# EAGLE schematic PCB_Accessoire_Puissance_ED0B (EAGLE 9.6.0)
APP_SCH: Alex; AUTHOR_SCH: Alexandre LEMAIRE; DESC_SCH: Power Switch 12V 10A; REV_HIST: 0
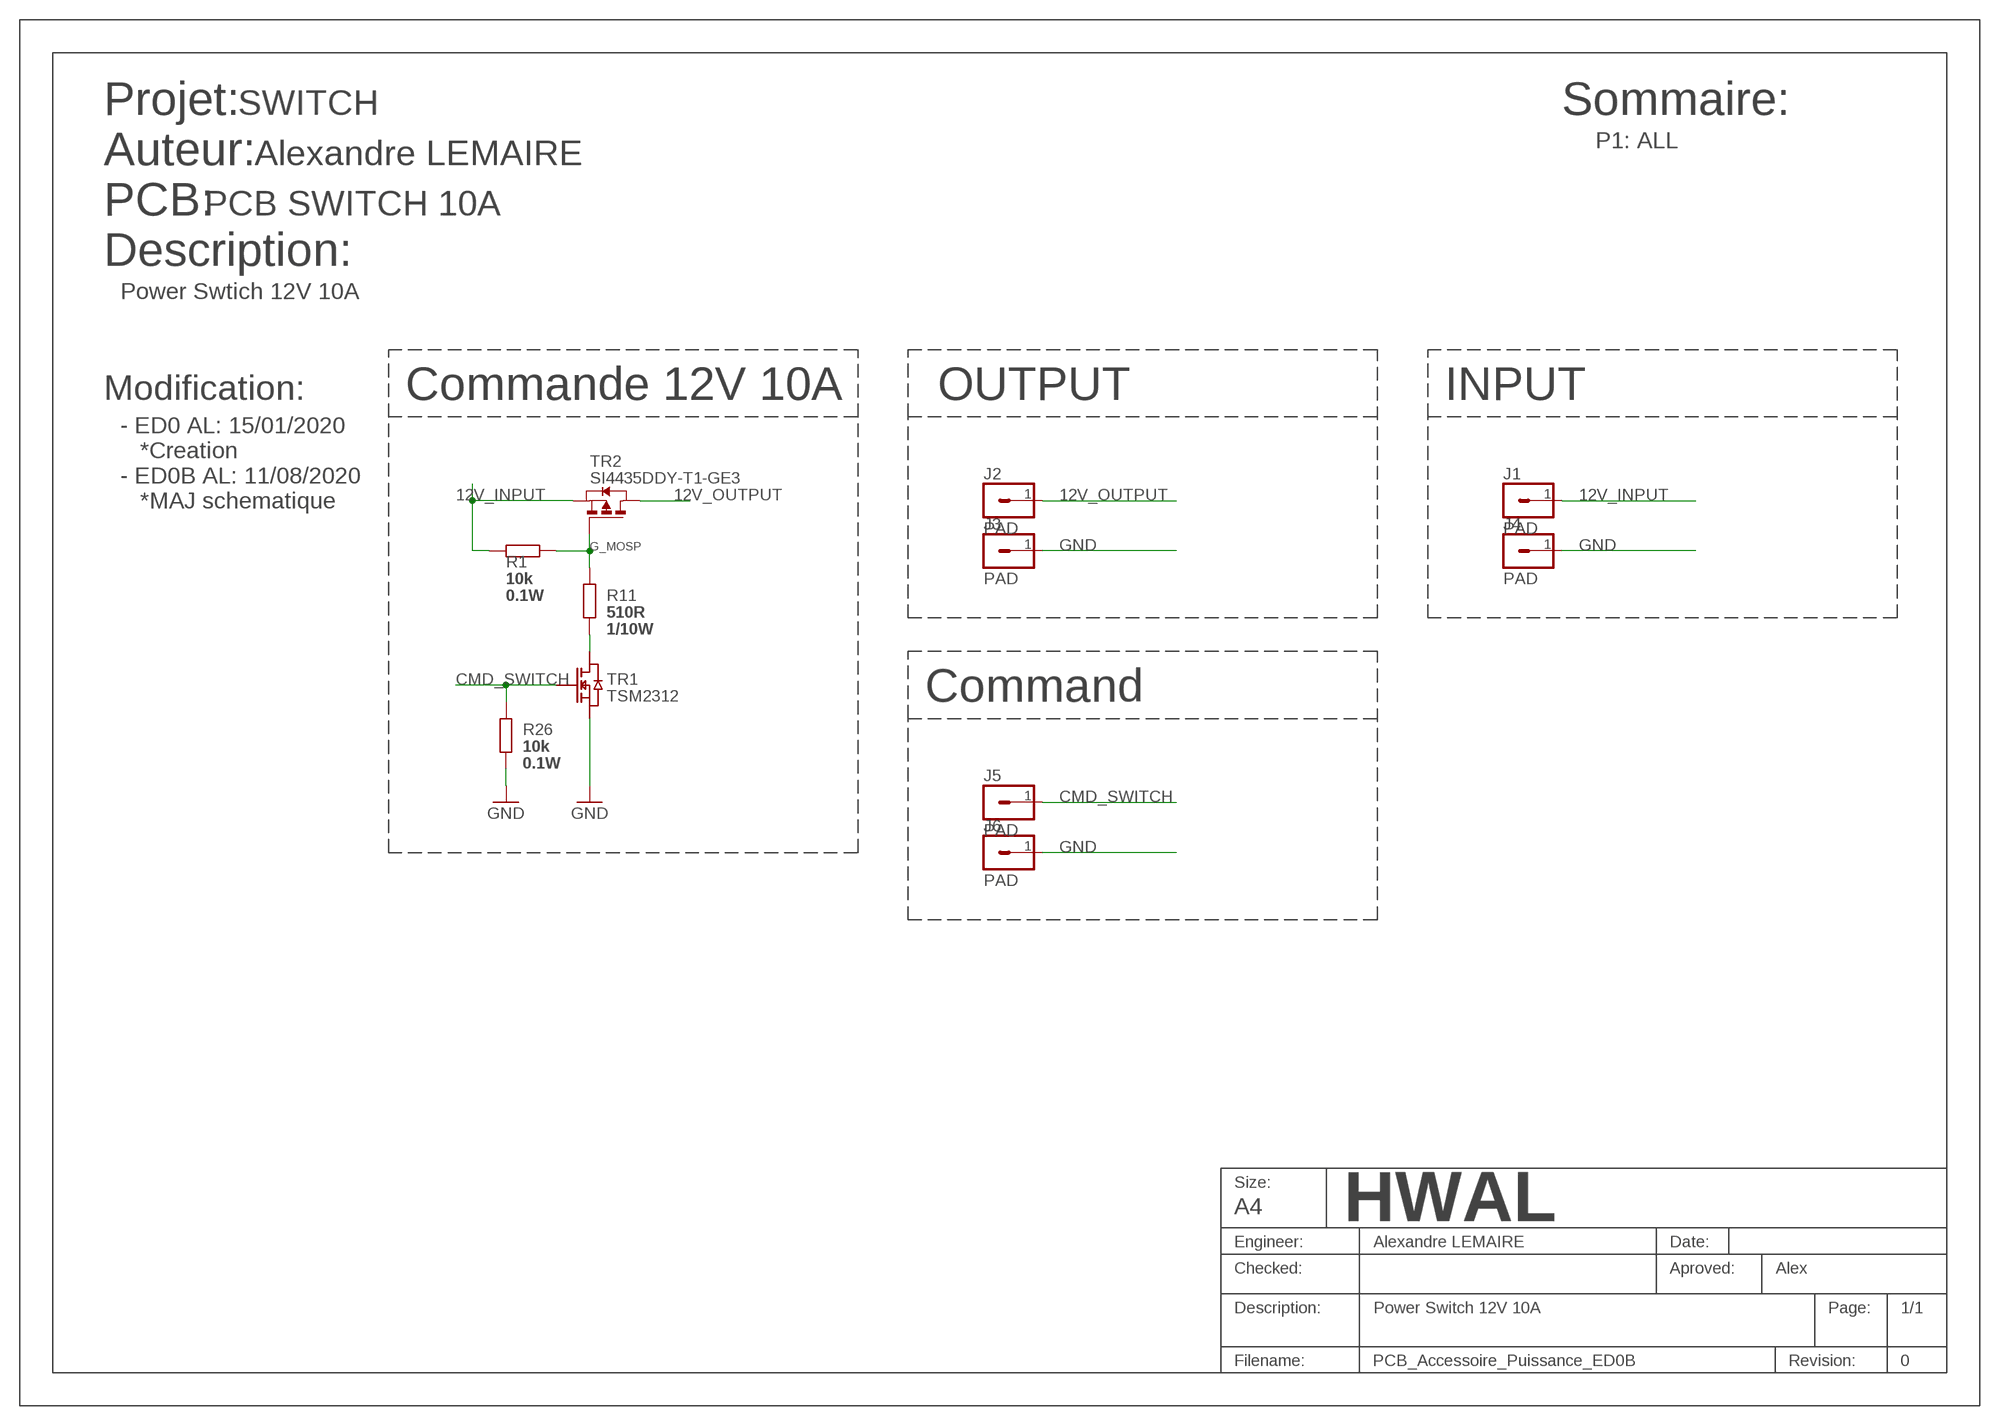
[diagram p0: schematic, sheet 1]

## Parts
J1  PAD  PLOT-1-2X3MM  [PAD_2X3MM]
J2  PAD  PLOT-1-2X3MM  [PAD_2X3MM]
J3  PAD  PLOT-1-2X3MM  [PAD_2X3MM]
J4  PAD  PLOT-1-2X3MM  [PAD_2X3MM]
J5  PAD  PLOT-1-2X3MM  [PAD_2X3MM]
J6  PAD  PLOT-1-2X3MM  [PAD_2X3MM]
R1  10k  RE_10KR_1%_0.1W_0603_50V_A  [R0603]
R11  510R  RC_510R_1%_0.1W_0603  [R0603]
R26  10k  RE_10KR_1%_0.1W_0603_50V_A  [R0603]
TR1  TSM2312  MOS_N_20V_5A_0.033W_SOT23  [SOT23]
TR2  SI4435DDY-T1-GE3  MOS_P_-30V_-10A_0,035OHM_SOIC8  [SOIC8]

## Nets
12V_INPUT: J1.1 R1.2 TR2.1(S) TR2.2(S) TR2.3(S)
12V_OUTPUT: J2.1 TR2.5(D) TR2.6(D) TR2.7(D) TR2.8(D)
CMD_SWITCH: J5.1 R26.2 TR1.1(G)
G_MOSP: R1.1 R11.2 TR2.4(G)
GND: J3.1 J4.1 J6.1 R26.1 TR1.2(S)
N$4: R11.1 TR1.3(D)

## Notes on the sheet
- Projet: | SWITCH | Sommaire:
- P1: ALL
- Auteur: | Alexandre LEMAIRE
- PCB: | PCB SWITCH 10A
- Description:
- Power Swtich 12V 10A
- Modification: | Commande 12V 10A | OUTPUT | INPUT
- - ED0 AL: 15/01/2020
     *Creation
- - ED0B AL: 11/08/2020
     *MAJ schematique
- Command

## Library data of the parts
J1-J6 = LMK_Connectique_PAD_CMS:PLOT-1-2X3MM: 2x3mm; MAJ_DATE: 22/08/2019; MAJ_ID: AL; POPULATED: NO
R1 R26 = LMK_RES_0603:RE_10KR_1%_0.1W_0603_50V_A: Resistor SMD, 10kΩ, 0603, 50 V, 0.1W, 1%, MULITCOMP - MCWR06X103 JTL; FARNELL: 2689413; FARNELL_PRICE: 0,0041; MAJ_DATE: 07/17; MAJ_ID: AL; MF: MULITCOMP; POPULATED: YES; POWER: 0.1W; REF_MF: MCWR06X103 JTL
R11 = LMK_RES_0603:RC_510R_1%_0.1W_0603: Resistor SMD, 510Ω, 0603, 0.1W, 1%; DIGIKEY: 311-510HRTR-ND; FARNELL: 2413712; MF: YAGEO; MOUSER: 603-RC0603FR-07510RL; POPULATED: YES; POWER: 1/10W; REF_MF: RC0603FR-07510RL; RS: 504-7571
TR1 = LMK_MOS_N:MOS_N_20V_5A_0.033W_SOT23: MOS N Channel, 20V, 5A, 0,033Ohms SOT23 TSM2312CX; DIGIKEY: TSM2312CX RFGCT-ND; DIGIKEY_PRICE: 0,463; FARNELL: 1864587; FARNELL_PRICE: 0,355; MAJ_DATE: 31/08/17; MAJ_ID: AL; MF: Taiwan Semiconductor; POPULATED: YES; REF_MF: TSM2312CX; RS: 7436059; RS_PRICE: 0,123; TME: TSM2312CX; TME_PRICE: 0,201
TR2 = LMK_MOS_P:MOS_P_-30V_-10A_0,035OHM_SOIC8: SI4435DDY-T1-GE3, P-channel MOSFET Transistor 8.1A 30V, 8-Pin SOIC <https://componentsearchengine.com/Images/3/SI4435DDY-T1-GE3.jpg> Source: Datasheet <http://docs-asia.electrocomponents.com/webdocs/0ed1/0900766b80ed1eb9.pdf>; DIGIKEY: SI4435DDY-T1-E3CT-ND; DIGIKEY_PRICE: 0,681; FARNELL: 2101446; FARNELL_PRICE: 0,82; HEIGHT: 1.75mm; MAJ_DATE: 25/09/17; MAJ_ID: AL; MF: Vishay; MOUSER: 781-SI4435DDY-T1-E3; MOUSER_PRICE: 0,639; POPULATED: YES; REF_MF: SI4435DDY-T1-GE3; RS: 7103339